# EAGLE schematic trezor_v1.1 (EAGLE 6.5.0)
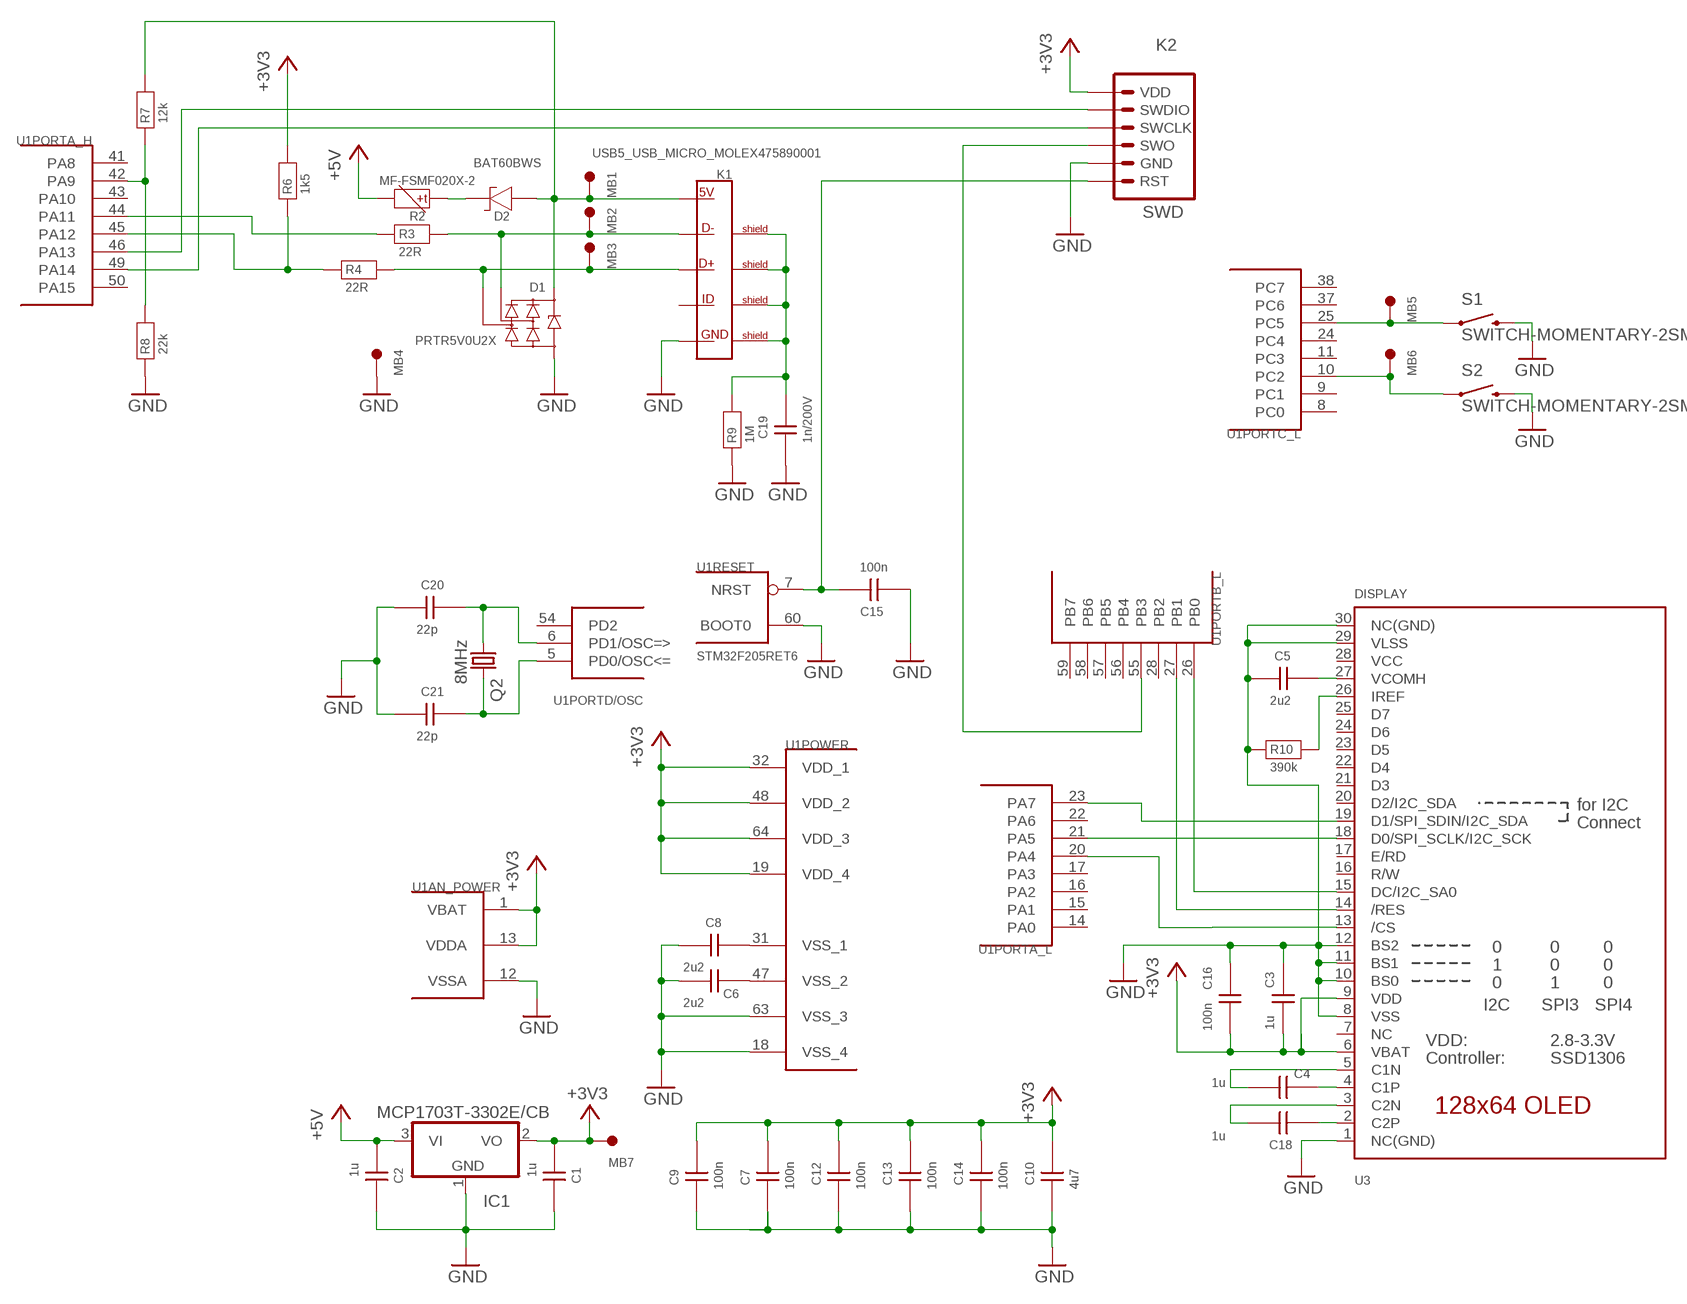
[diagram p0: schematic, sheet 1]

## Parts
C1  1u  C_0402  [0402]
C2  1u  C_0402  [0402]
C3  1u  C_0402  [0402]
C4  1u  C_0402  [0402]
C5  2u2  C_0603  [0603]
C6  2u2  C_0402  [0402]
C7  100n  C_0402  [0402]
C8  2u2  C_0402  [0402]
C9  100n  C_0402  [0402]
C10  4u7  C_0603  [0603]
C12  100n  C_0402  [0402]
C13  100n  C_0402  [0402]
C14  100n  C_0402  [0402]
C15  100n  C_0402  [0402]
C16  100n  C_0402  [0402]
C18  1u  C_0402  [0402]
C19  1n/200V  C_0603  [0603]
C20  22p  C_0402  [0402]
C21  22p  C_0402  [0402]
D1  PRTR5V0U2X  PRTR5V0_SOT143B  [SOT143B]
D2  BAT60BWS  DS_SOD323  [SOD323]
IC1  MCP1703T-3302E/CB  MCP1703CB  [SOT23]
K1  USB5_USB_MICRO_MOLEX475890001  [USB_MICRO-MOLEX475890001]
K2  SWD  [SWD]
MB1  MB_1.50  [MB1.5]
MB2  MB_1.50  [MB1.5]
MB3  MB_1.50  [MB1.5]
MB4  MB_1.50  [MB1.5]
MB5  MB_1.50  [MB1.5]
MB6  MB_1.50  [MB1.5]
MB7  MB_1.50  [MB1.5]
Q2  8MHz  CRYSTALCTS406  [CTS406]
R2  MF-FSMF020X-2  POLYSWITCH_0603  [0603]
R3  22R  R_0402  [0402]
R4  22R  R_0402  [0402]
R6  1k5  R_0402  [0402]
R7  12k  R_0402  [0402]
R8  22k  R_0402  [0402]
R9  1M  R_0603  [0603]
R10  390k  R_0402  [0402]
S1  SWITCH-MOMENTARY-2SMD  [TACTILE_SWITCH_SMD]
S2  SWITCH-MOMENTARY-2SMD  [TACTILE_SWITCH_SMD]
U1  STM32F205RET6  STM32F10XRXT6  [TQFP64]
U3  DISPLAY  DISP_OLED_UG-2864HSWEG010.96"  [UG-2864HSWEG01_0.96IN_WRAPAROUND]

## Nets
+3V3: C1.P$1 C3.P$1 C7.P$2 C9.P$2 C10.2 C12.P$2 C13.P$2 C14.P$2 C16.P$1 IC1.2(VO) K2.6(VDD) MB7.1 R6.P$2 U1.1(AN_POWER:VBAT) U1.13(AN_POWER:VDDA) U1.19(POWER:VDD_4) U1.32(POWER:VDD_1) U1.48(POWER:VDD_2) U1.64(POWER:VDD_3) U3.6(VBAT) U3.9(VDD)
+5V: C2.P$1 IC1.3(VI) R2.2
GND: C1.P$2 C2.P$2 C3.P$2 C5.1 C6.P$1 C7.P$1 C8.P$1 C9.P$1 C10.1 C12.P$1 C13.P$1 C14.P$1 C15.P$1 C16.P$2 C19.1 C20.P$1 C21.P$1 D1.1(GND) IC1.1(GND) K1.5(5_GND) K2.2(GND) MB4.1 R8.P$1 R9.1 R10.P$1 S1.3 S1.4 S2.3 S2.4 U1.12(AN_POWER:VSSA) U1.18(POWER:VSS_4) U1.60(RESET:BOOT0) U1.63(POWER:VSS_3) U3.1(NC(GND)) U3.8(VSS) U3.10(BS0) U3.11(BS1) U3.12(BS2) U3.29(VLSS) U3.30(NC(GND))
N$1: U1.23(PORTA_L:PA7) U3.19(D1/SPI_SDIN/I2C_SDA)
N$2: C15.P$2 K2.1(RST) U1.7(RESET:NRST)
N$3: U1.26(PORTB_L:PB0) U3.15(DC/I2C_SA0)
N$4: C8.P$2 U1.31(POWER:VSS_1)
N$5: U1.21(PORTA_L:PA5) U3.18(D0/SPI_SCLK/I2C_SCK)
N$6: C5.2 U3.27(VCOMH)
N$7: U1.27(PORTB_L:PB1) U3.14(/RES)
N$8: C6.P$2 U1.47(POWER:VSS_2)
N$9: R10.P$2 U3.26(IREF)
N$10: C18.P$1 U3.2(C2P)
N$11: C4.P$1 U3.4(C1P)
N$12: C18.P$2 U3.3(C2N)
N$13: C4.P$2 U3.5(C1N)
N$14: K2.3(SWO) U1.55(PORTB_L:PB3)
N$15: K2.5(SWDIO) U1.46(PORTA_H:PA13)
N$16: U1.20(PORTA_L:PA4) U3.13(/CS)
N$17: K2.4(SWCLK) U1.49(PORTA_H:PA14)
N$18: R3.P$1 U1.44(PORTA_H:PA11)
N$19: MB5.1 S1.1 S1.2 U1.25(PORTC_L:PC5)
N$20: MB6.1 S2.1 S2.2 U1.10(PORTC_L:PC2)
N$21: D1.4(VCC) D2.A K1.1(1_5V) MB1.1 R7.P$2
N$22: D2.K R2.1
N$23: D1.2(I/O1) K1.2(2_D-) MB2.1 R3.P$2
N$24: D1.3(I/O2) K1.3(3_D+) MB3.1 R4.P$2
N$26: C19.2 K1.S1_BOT(SHIELD_1) K1.S1_TOP(SHIELD_1) K1.S2_BOT(SHIELD_2) K1.S2_TOP(SHIELD_2) K1.S3_BOT(SHIELD_3) K1.S3_TOP(SHIELD_3) K1.S4_BOT(SHIELD_4) K1.S4_TOP(SHIELD_4) K1.SA(SHIELD_1) K1.SB(SHIELD_2) R9.2
N$27: R7.P$1 R8.P$2 U1.42(PORTA_H:PA9)
USB_D_P: R4.P$1 R6.P$1 U1.45(PORTA_H:PA12)
XTAL1: C20.P$2 Q2.1 U1.6(PORTD/OSC:PD1/OSC=>)
XTAL2: C21.P$2 Q2.3 U1.5(PORTD/OSC:PD0/OSC<=)
Unconnected: K1.4(4_ID) U1.2(PORTC_H:PC13) U1.3(PORTC_H:PC14) U1.4(PORTC_H:PC15) U1.8(PORTC_L:PC0) U1.9(PORTC_L:PC1) U1.11(PORTC_L:PC3) U1.14(PORTA_L:PA0) U1.15(PORTA_L:PA1) U1.16(PORTA_L:PA2) U1.17(PORTA_L:PA3) U1.22(PORTA_L:PA6) U1.24(PORTC_L:PC4) U1.28(PORTB_L:PB2) U1.29(PORTB_H:PB10) U1.30(PORTB_H:PB11) U1.33(PORTB_H:PB12) U1.34(PORTB_H:PB13) U1.35(PORTB_H:PB14) U1.36(PORTB_H:PB15) U1.37(PORTC_L:PC6) U1.38(PORTC_L:PC7) U1.39(PORTC_H:PC8) U1.40(PORTC_H:PC9) U1.41(PORTA_H:PA8) U1.43(PORTA_H:PA10) U1.50(PORTA_H:PA15) U1.51(PORTC_H:PC10) U1.52(PORTC_H:PC11) U1.53(PORTC_H:PC12) U1.54(PORTD/OSC:PD2) U1.56(PORTB_L:PB4) U1.57(PORTB_L:PB5) U1.58(PORTB_L:PB6) U1.59(PORTB_L:PB7) U1.61(PORTB_H:PB8) U1.62(PORTB_H:PB9) U3.7(NC) U3.16(R/W) U3.17(E/RD) U3.20(D2/I2C_SDA) U3.21(D3) U3.22(D4) U3.23(D5) U3.24(D6) U3.25(D7)

## Power pins joined to a net without a drawn wire
VCC: U3.28(VCC)

## Library data of the parts
C1-C10 C12-C16 C18-C21 = vyber:C
D1 = vyber:PRTR5V0
D2 = vyber:DS
IC1 = linear:MCP1703: 250 mA, 16V, Low Quiescent Current LDO Regulator Source: http://ww1.microchip.com/downloads/en/DeviceDoc/22049b.pdf
K1 = vyber:USB5
K2 = fabhack:SWD: SWD Miniature connector for ARM programming.
MB1-MB7 = vyber:MB
Q2 = crystal:CRYSTAL: CRYSTAL
R2 = vyber:POLYSWITCH
R3 R4 R6-R10 = vyber:R
S1 S2 = SparkFun-Electromechanical:SWITCH-MOMENTARY-2: Various NO switches- pushbuttons, reed, etc
U1 = stm32:STM32F10XRXT6: STM32F101/103 64pin LQFP
U3 = microbuilder:DISP_OLED_UG-2864HSWEG01: UG-2864HSWEG01 OLED display Both 1.3" and 0.96" models share the same FPC tab footprint, only the screen dimensions vary.